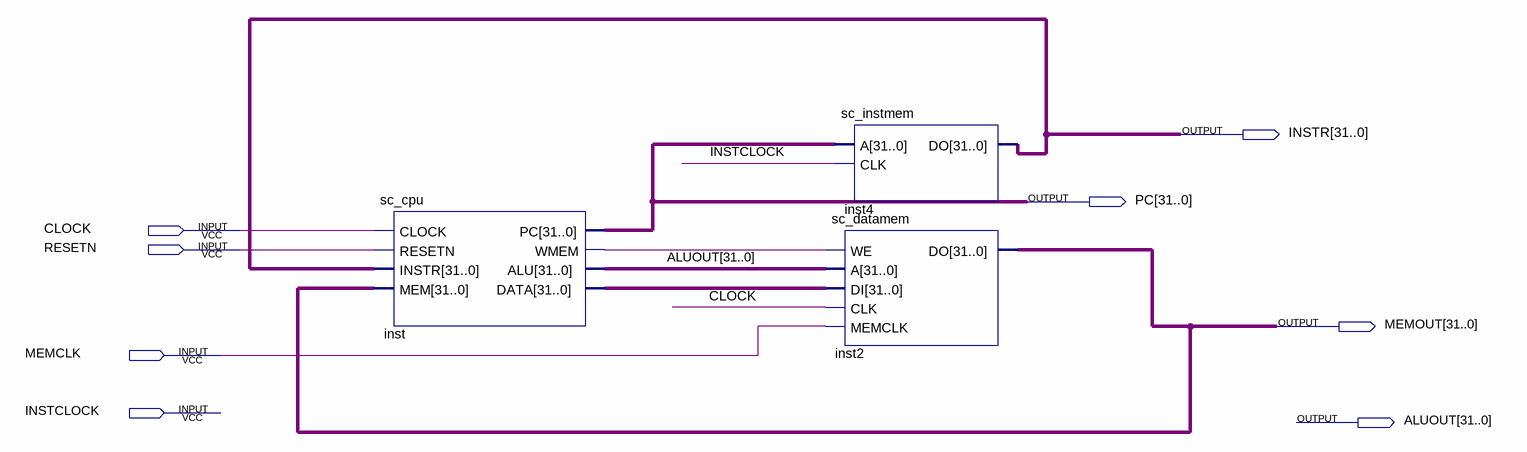
[diagram p0: schematic sheet]
// Quartus schematic cpu.bdf as structural Verilog: 3 symbols, 8 pins
module cpu (
  input  CLOCK,
  input  RESETN,
  input  MEMCLK,
  input  INSTCLOCK,
  output [31:0] INSTR,
  output [31:0] PC,
  output [31:0] MEMOUT,
  output [31:0] ALUOUT
);

  wire inst_wmem;
  wire [31:0] inst_data;

  sc_cpu inst (
    .CLOCK(CLOCK), .RESETN(RESETN), .INSTR(INSTR), .MEM(MEMOUT), .PC(PC), .WMEM(inst_wmem), .ALU(ALUOUT),
    .DATA(inst_data));
  sc_datamem inst2 (.WE(inst_wmem), .A(ALUOUT), .DI(inst_data), .CLK(CLOCK), .MEMCLK(MEMCLK), .DO(MEMOUT));
  sc_instmem inst4 (.A(PC), .CLK(INSTCLOCK), .DO(INSTR));
endmodule
